# EAGLE design ENTRENADOR_SMD (EAGLE 9.6.2)
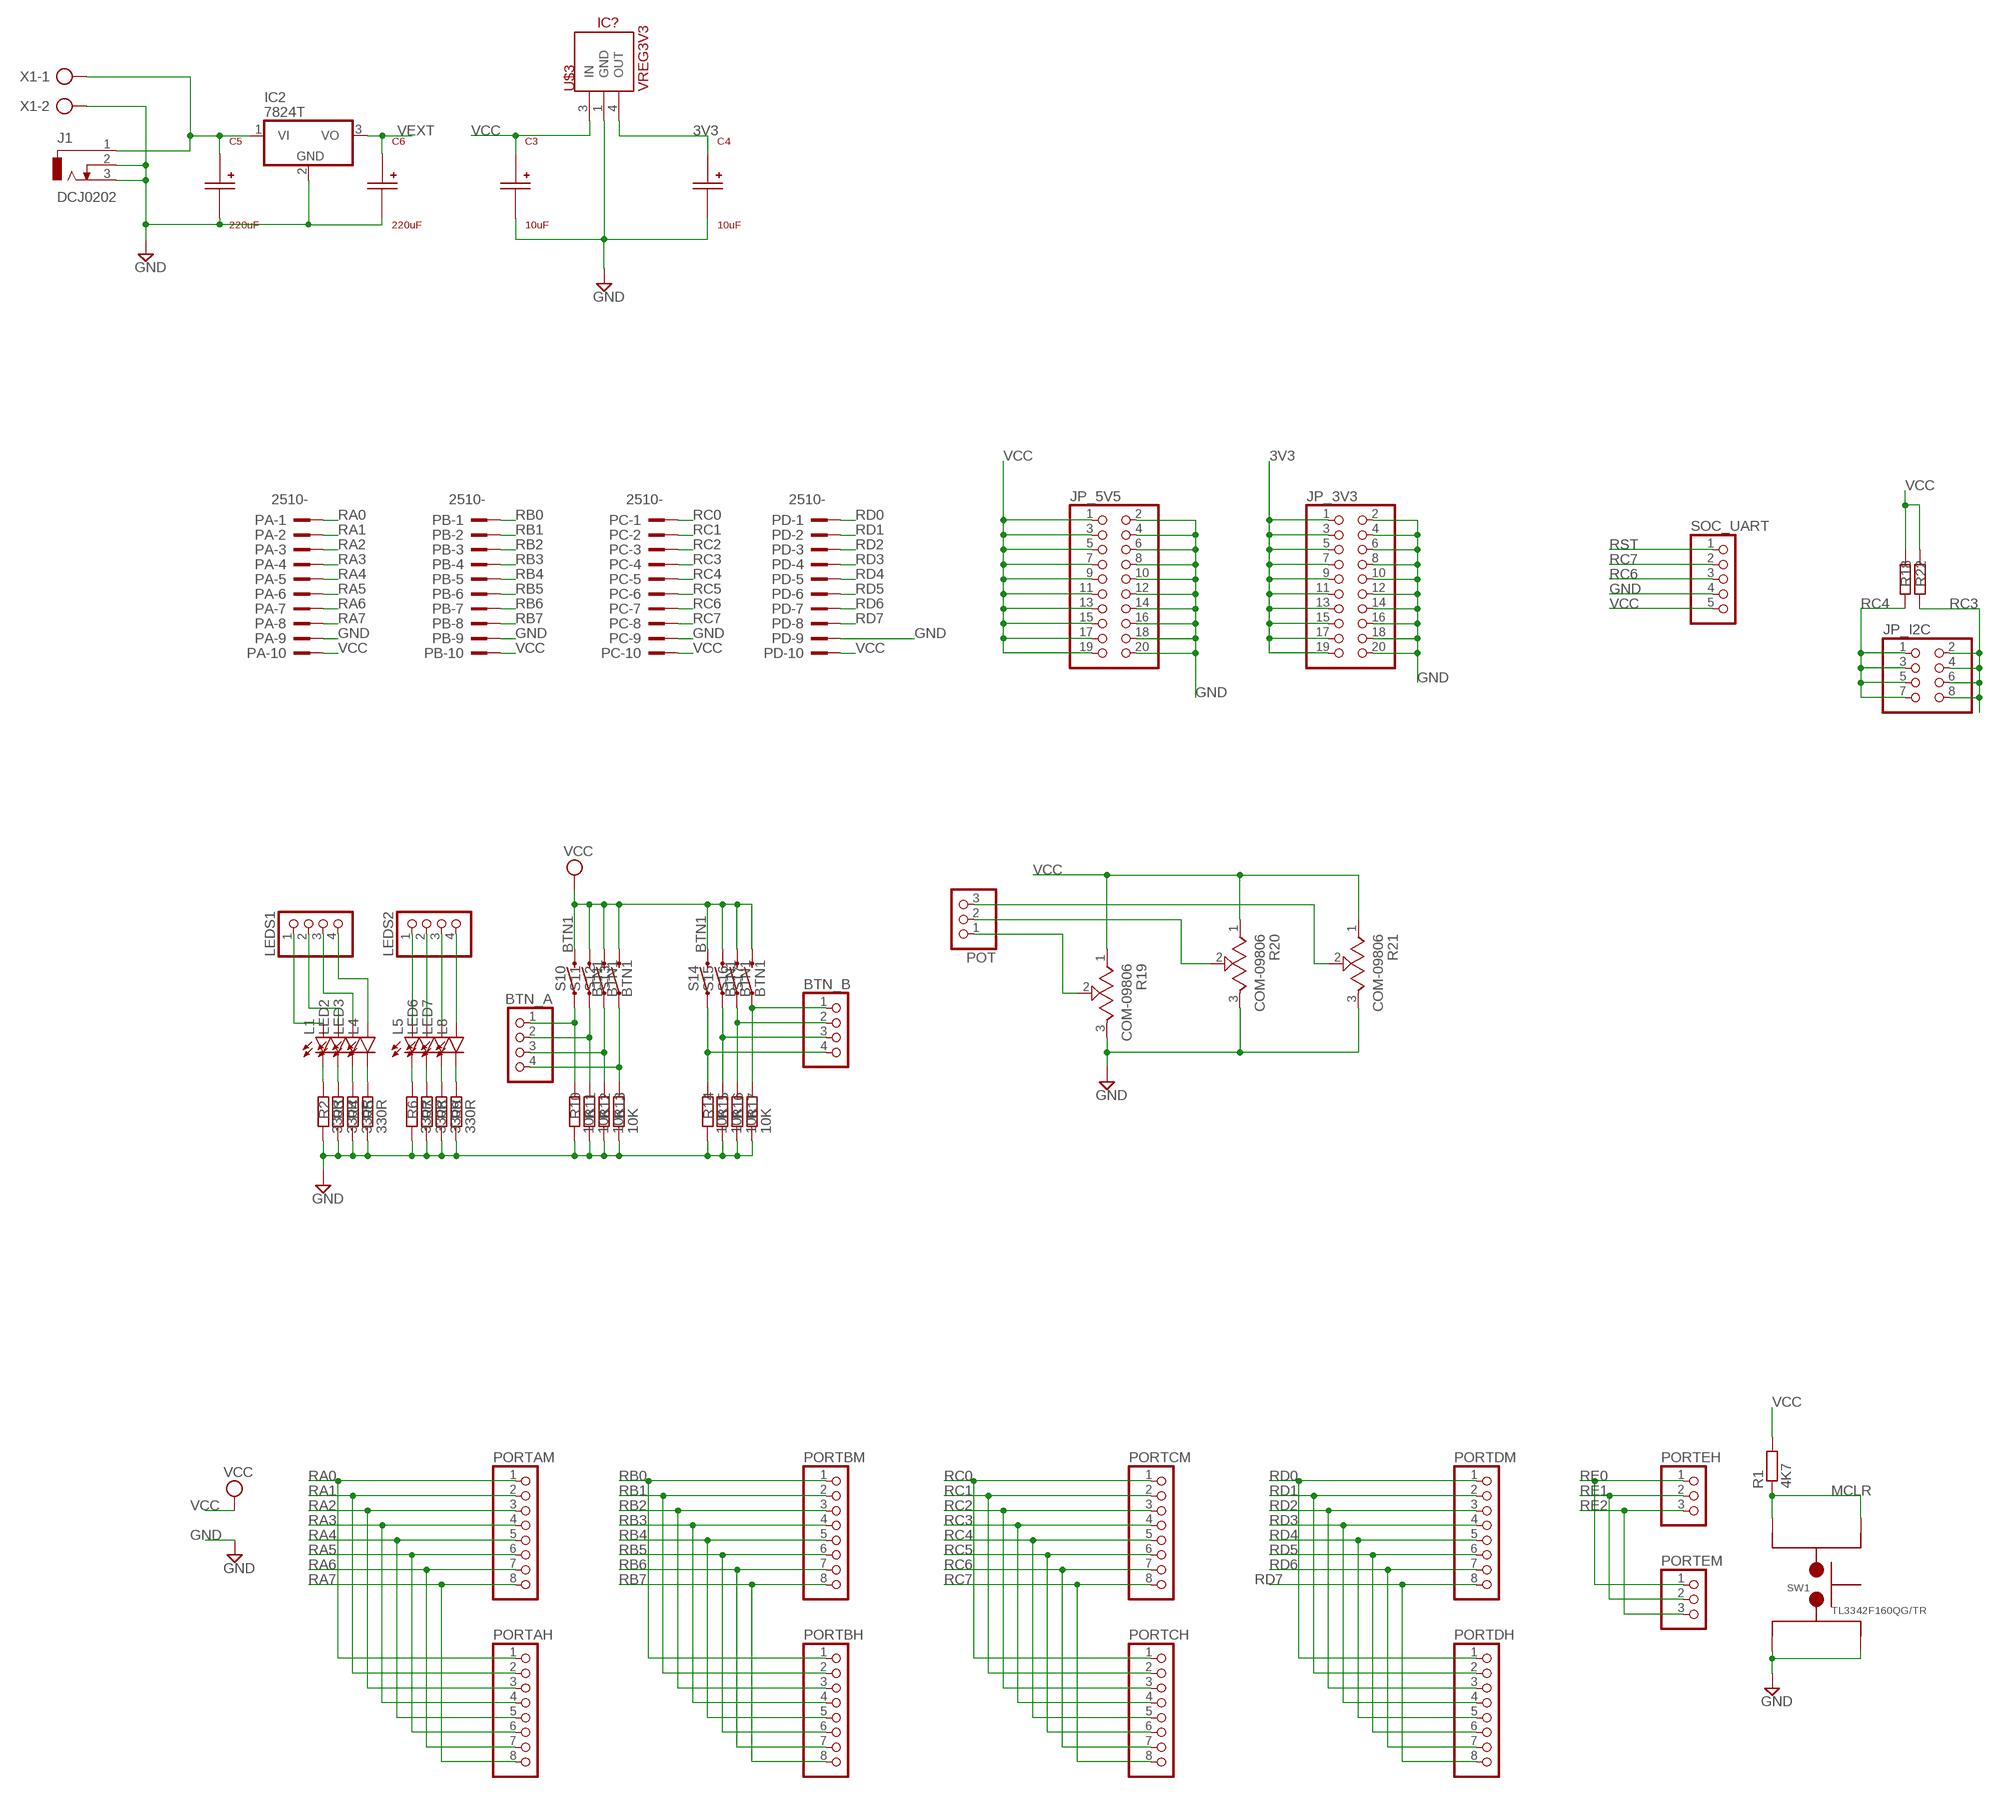
[diagram p0: schematic, sheet 1, part 1 of 2]
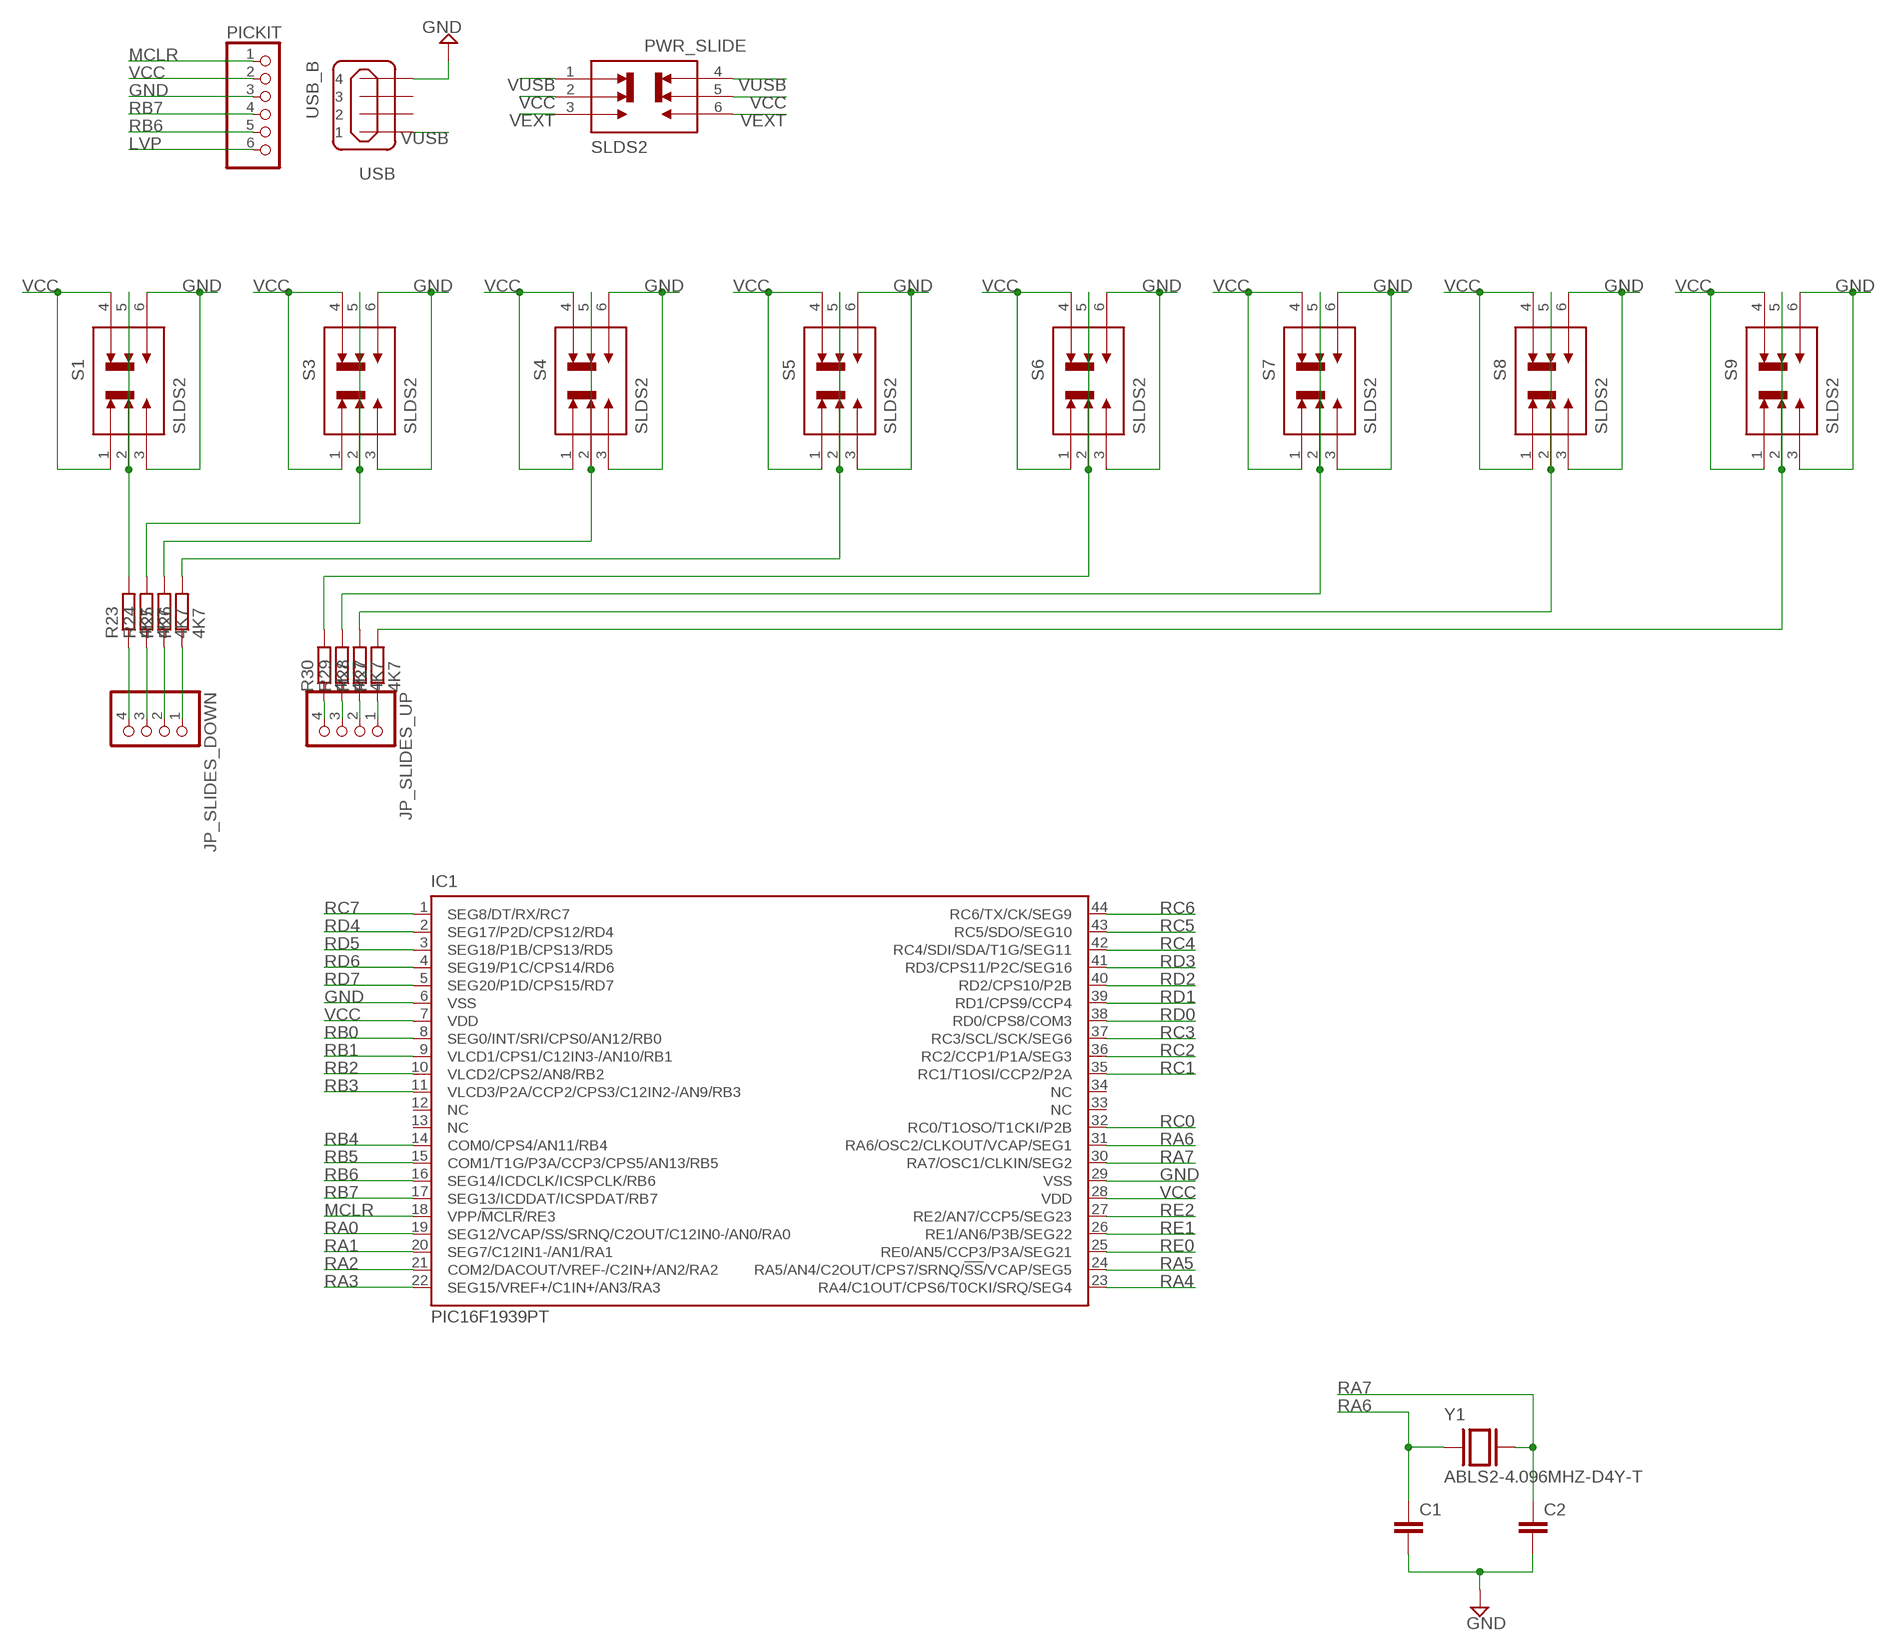
[diagram p1: schematic, sheet 1, part 2 of 2]

## Parts
BTN_A  PINHD-1X4  [1X04]
BTN_B  PINHD-1X4  [1X04]
C1  C-EUC0805K  [C0805K]
C2  C-EUC0805K  [C0805K]
C3  10uF  CAPA  [CAPA]
C4  10uF  CAPA  [CAPA]
C5  220uF  CAPA  [CAPA]
C6  220uF  CAPA  [CAPA]
IC1  PIC16F1939PT  [TQFP44]
IC2  7824T  [TO220H]
J1  DCJ0202  [DCJ0202]
JP_3V3  PINHD-2X10  [2X10]
JP_5V5  PINHD-2X10  [2X10]
JP_I2C  PINHD-2X4  [2X04]
JP_SLIDES_DOWN  PINHD-1X4  [1X04]
JP_SLIDES_UP  PINHD-1X4  [1X04]
L1  LEDCHIP-LED0805  [CHIP-LED0805]
L4  LEDCHIP-LED0805  [CHIP-LED0805]
L5  LEDCHIP-LED0805  [CHIP-LED0805]
L8  LEDCHIP-LED0805  [CHIP-LED0805]
LED2  LEDCHIP-LED0805  [CHIP-LED0805]
LED3  LEDCHIP-LED0805  [CHIP-LED0805]
LED6  LEDCHIP-LED0805  [CHIP-LED0805]
LED7  LEDCHIP-LED0805  [CHIP-LED0805]
LEDS1  PINHD-1X4  [1X04]
LEDS2  PINHD-1X4  [1X04]
PA  2510-  [PAK100/2500-10]
PB  2510-  [PAK100/2500-10]
PC  2510-  [PAK100/2500-10]
PD  2510-  [PAK100/2500-10]
PICKIT  PINHD-1X6  [1X06]
PORTAH  PINHD-1X8  [1X08]
PORTAM  PINHD-1X8  [1X08]
PORTBH  PINHD-1X8  [1X08]
PORTBM  PINHD-1X8  [1X08]
PORTCH  PINHD-1X8  [1X08]
PORTCM  PINHD-1X8  [1X08]
PORTDH  PINHD-1X8  [1X08]
PORTDM  PINHD-1X8  [1X08]
PORTEH  PINHD-1X3  [1X03]
PORTEM  PINHD-1X3  [1X03]
POT  PINHD-1X3  [1X03]
PWR_SLIDE  SLDS2  JS202011SCQN  [SW_JS202011SCQN]
R1  4K7  R-EU_R0805  [R0805]
R2  330R  R-EU_R0805  [R0805]
R3  330R  R-EU_R0805  [R0805]
R4  330R  R-EU_R0805  [R0805]
R5  330R  R-EU_R0805  [R0805]
R6  330R  R-EU_R0805  [R0805]
R7  330R  R-EU_R0805  [R0805]
R8  330R  R-EU_R0805  [R0805]
R9  330R  R-EU_R0805  [R0805]
R10  10K  R-EU_R0805  [R0805]
R11  10K  R-EU_R0805  [R0805]
R12  10K  R-EU_R0805  [R0805]
R13  10K  R-EU_R0805  [R0805]
R14  10K  R-EU_R0805  [R0805]
R15  10K  R-EU_R0805  [R0805]
R16  10K  R-EU_R0805  [R0805]
R17  10K  R-EU_R0805  [R0805]
R18  R-EU_R0805  [R0805]
R19  COM-09806  [TRIM_COM-09806]
R20  COM-09806  [TRIM_COM-09806]
R21  COM-09806  [TRIM_COM-09806]
R22  R-EU_R0805  [R0805]
R23  4K7  R-EU_R0805  [R0805]
R24  4K7  R-EU_R0805  [R0805]
R25  4K7  R-EU_R0805  [R0805]
R26  4K7  R-EU_R0805  [R0805]
R27  4K7  R-EU_R0805  [R0805]
R28  4K7  R-EU_R0805  [R0805]
R29  4K7  R-EU_R0805  [R0805]
R30  4K7  R-EU_R0805  [R0805]
S1  SLDS2  JS202011SCQN  [SW_JS202011SCQN]
S3  SLDS2  JS202011SCQN  [SW_JS202011SCQN]
S4  SLDS2  JS202011SCQN  [SW_JS202011SCQN]
S5  SLDS2  JS202011SCQN  [SW_JS202011SCQN]
S6  SLDS2  JS202011SCQN  [SW_JS202011SCQN]
S7  SLDS2  JS202011SCQN  [SW_JS202011SCQN]
S8  SLDS2  JS202011SCQN  [SW_JS202011SCQN]
S9  SLDS2  JS202011SCQN  [SW_JS202011SCQN]
S10  BTN1  PTS636SM25FSMTRLFS-SMD-6.0X3.5MM  [TACTILE_SWITCH_SMD_6.0X3.5MM]
S11  BTN1  PTS636SM25FSMTRLFS-SMD-6.0X3.5MM  [TACTILE_SWITCH_SMD_6.0X3.5MM]
S12  BTN1  PTS636SM25FSMTRLFS-SMD-6.0X3.5MM  [TACTILE_SWITCH_SMD_6.0X3.5MM]
S13  BTN1  PTS636SM25FSMTRLFS-SMD-6.0X3.5MM  [TACTILE_SWITCH_SMD_6.0X3.5MM]
S14  BTN1  PTS636SM25FSMTRLFS-SMD-6.0X3.5MM  [TACTILE_SWITCH_SMD_6.0X3.5MM]
S15  BTN1  PTS636SM25FSMTRLFS-SMD-6.0X3.5MM  [TACTILE_SWITCH_SMD_6.0X3.5MM]
S16  BTN1  PTS636SM25FSMTRLFS-SMD-6.0X3.5MM  [TACTILE_SWITCH_SMD_6.0X3.5MM]
S17  BTN1  PTS636SM25FSMTRLFS-SMD-6.0X3.5MM  [TACTILE_SWITCH_SMD_6.0X3.5MM]
SOC_UART  PINHD-1X5  [1X05]
SW1  TL3342F160QG/TR  [SW_TL3342F160QG/TR]
U$3  VREG3V3  [VREG3V3]
USB  USB_B  MINI-USB_4P-85-32004-10X  [85-32004-10X]
X1  AK300/2  [AK300/2]
Y1  ABLS2-4.096MHZ-D4Y-T  [XTAL_ABLS2-4.096MHZ-D4Y-T]

## Nets
3V3: C4.P JP_3V3.1 JP_3V3.3 JP_3V3.5 JP_3V3.7 JP_3V3.9 JP_3V3.11 JP_3V3.13 JP_3V3.15 JP_3V3.17 JP_3V3.19 U$3.4(OUT)
GND: C1.2 C2.2 C3.N C4.N C5.N C6.N IC1.6(VSS) IC1.29(VSS) IC2.2(GND) J1.2 J1.3 JP_3V3.2 JP_3V3.4 JP_3V3.6 JP_3V3.8 JP_3V3.10 JP_3V3.12 JP_3V3.14 JP_3V3.16 JP_3V3.18 JP_3V3.20 JP_5V5.2 JP_5V5.4 JP_5V5.6 JP_5V5.8 JP_5V5.10 JP_5V5.12 JP_5V5.14 JP_5V5.16 JP_5V5.18 JP_5V5.20 PA.9 PB.9 PC.9 PD.9 PICKIT.3 R2.1 R3.1 R4.1 R5.1 R6.1 R7.1 R8.1 R9.1 R10.1 R11.1 R12.1 R13.1 R14.1 R15.1 R16.1 R17.1 R19.3(CW) R20.3(CW) R21.3(CW) S1.3 S1.6 S3.3 S3.6 S4.3 S4.6 S5.3 S5.6 S6.3 S6.6 S7.3 S7.6 S8.3 S8.6 S9.3 S9.6 SOC_UART.4 SW1.1 SW1.2 U$3.1(GND) USB.4 X1.2
LVP: PICKIT.6
MCLR: IC1.18(VPP/!MCLR!/RE3) PICKIT.1 R1.1 SW1.3 SW1.4
N$1: R23.2 S1.2 S1.5
N$2: R24.2 S3.2 S3.5
N$3: R25.2 S4.2 S4.5
N$4: R26.2 S5.2 S5.5
N$5: R30.2 S6.2 S6.5
N$6: R29.2 S7.2 S7.5
N$7: R28.2 S8.2 S8.5
N$8: R27.2 S9.2 S9.5
N$9: L1.C R2.2
N$10: LED2.C R3.2
N$11: LED3.C R4.2
N$12: L4.C R5.2
N$13: L5.C R6.2
N$14: LED6.C R7.2
N$15: LED7.C R8.2
N$16: L8.C R9.2
N$17: L1.A LEDS1.1
N$18: LED2.A LEDS1.2
N$19: LED3.A LEDS1.3
N$20: L4.A LEDS1.4
N$21: L5.A LEDS2.1
N$22: LED6.A LEDS2.2
N$23: LED7.A LEDS2.3
N$24: L8.A LEDS2.4
N$25: BTN_A.1 R10.2 S10.1
N$26: BTN_A.2 R11.2 S11.1
N$27: BTN_A.3 R12.2 S12.1
N$28: BTN_A.4 R13.2 S13.1
N$29: BTN_B.4 R14.2 S14.1
N$30: BTN_B.3 R15.2 S15.1
N$31: BTN_B.2 R16.2 S16.1
N$32: BTN_B.1 R17.2 S17.1
N$33: POT.3 R21.2(WIPER)
N$34: POT.2 R20.2(WIPER)
N$35: POT.1 R19.2(WIPER)
N$36: C5.P IC2.1(VI) J1.1 X1.1
N$37: JP_SLIDES_UP.1 R27.1
N$38: JP_SLIDES_UP.2 R28.1
N$39: JP_SLIDES_UP.3 R29.1
N$40: JP_SLIDES_DOWN.1 R26.1
N$41: JP_SLIDES_DOWN.2 R25.1
N$42: JP_SLIDES_DOWN.3 R24.1
N$43: JP_SLIDES_DOWN.4 R23.1
N$44: JP_SLIDES_UP.4 R30.1
RA0: IC1.19(SEG12/VCAP/SS/SRNQ/C2OUT/C12IN0-/AN0/RA0) PA.1 PORTAH.1 PORTAM.1
RA1: IC1.20(SEG7/C12IN1-/AN1/RA1) PA.2 PORTAH.2 PORTAM.2
RA2: IC1.21(COM2/DACOUT/VREF-/C2IN+/AN2/RA2) PA.3 PORTAH.3 PORTAM.3
RA3: IC1.22(SEG15/VREF+/C1IN+/AN3/RA3) PA.4 PORTAH.4 PORTAM.4
RA4: IC1.23(RA4/C1OUT/CPS6/T0CKI/SRQ/SEG4) PA.5 PORTAH.5 PORTAM.5
RA5: IC1.24(RA5/AN4/C2OUT/CPS7/SRNQ/!SS!/VCAP/SEG5) PA.6 PORTAH.6 PORTAM.6
RA6: C1.1 IC1.31(RA6/OSC2/CLKOUT/VCAP/SEG1) PA.7 PORTAH.7 PORTAM.7 Y1.1
RA7: C2.1 IC1.30(RA7/OSC1/CLKIN/SEG2) PA.8 PORTAH.8 PORTAM.8 Y1.2
RB0: IC1.8(SEG0/INT/SRI/CPS0/AN12/RB0) PB.1 PORTBH.1 PORTBM.1
RB1: IC1.9(VLCD1/CPS1/C12IN3-/AN10/RB1) PB.2 PORTBH.2 PORTBM.2
RB2: IC1.10(VLCD2/CPS2/AN8/RB2) PB.3 PORTBH.3 PORTBM.3
RB3: IC1.11(VLCD3/P2A/CCP2/CPS3/C12IN2-/AN9/RB3) PB.4 PORTBH.4 PORTBM.4
RB4: IC1.14(COM0/CPS4/AN11/RB4) PB.5 PORTBH.5 PORTBM.5
RB5: IC1.15(COM1/T1G/P3A/CCP3/CPS5/AN13/RB5) PB.6 PORTBH.6 PORTBM.6
RB6: IC1.16(SEG14/ICDCLK/ICSPCLK/RB6) PB.7 PICKIT.5 PORTBH.7 PORTBM.7
RB7: IC1.17(SEG13/ICDDAT/ICSPDAT/RB7) PB.8 PICKIT.4 PORTBH.8 PORTBM.8
RC0: IC1.32(RC0/T1OSO/T1CKI/P2B) PC.1 PORTCH.1 PORTCM.1
RC1: IC1.35(RC1/T1OSI/CCP2/P2A) PC.2 PORTCH.2 PORTCM.2
RC2: IC1.36(RC2/CCP1/P1A/SEG3) PC.3 PORTCH.3 PORTCM.3
RC3: IC1.37(RC3/SCL/SCK/SEG6) JP_I2C.2 JP_I2C.4 JP_I2C.6 JP_I2C.8 PC.4 PORTCH.4 PORTCM.4 R22.1
RC4: IC1.42(RC4/SDI/SDA/T1G/SEG11) JP_I2C.1 JP_I2C.3 JP_I2C.5 JP_I2C.7 PC.5 PORTCH.5 PORTCM.5 R18.1
RC5: IC1.43(RC5/SDO/SEG10) PC.6 PORTCH.6 PORTCM.6
RC6: IC1.44(RC6/TX/CK/SEG9) PC.7 PORTCH.7 PORTCM.7 SOC_UART.3
RC7: IC1.1(SEG8/DT/RX/RC7) PC.8 PORTCH.8 PORTCM.8 SOC_UART.2
RD0: IC1.38(RD0/CPS8/COM3) PD.1 PORTDH.1 PORTDM.1
RD1: IC1.39(RD1/CPS9/CCP4) PD.2 PORTDH.2 PORTDM.2
RD2: IC1.40(RD2/CPS10/P2B) PD.3 PORTDH.3 PORTDM.3
RD3: IC1.41(RD3/CPS11/P2C/SEG16) PD.4 PORTDH.4 PORTDM.4
RD4: IC1.2(SEG17/P2D/CPS12/RD4) PD.5 PORTDH.5 PORTDM.5
RD5: IC1.3(SEG18/P1B/CPS13/RD5) PD.6 PORTDH.6 PORTDM.6
RD6: IC1.4(SEG19/P1C/CPS14/RD6) PD.7 PORTDH.7 PORTDM.7
RD7: IC1.5(SEG20/P1D/CPS15/RD7) PD.8 PORTDH.8 PORTDM.8
RE0: IC1.25(RE0/AN5/CCP3/P3A/SEG21) PORTEH.1 PORTEM.1
RE1: IC1.26(RE1/AN6/P3B/SEG22) PORTEH.2 PORTEM.2
RE2: IC1.27(RE2/AN7/CCP5/SEG23) PORTEH.3 PORTEM.3
RST: SOC_UART.1
VCC: C3.P IC1.7(VDD) IC1.28(VDD) JP_5V5.1 JP_5V5.3 JP_5V5.5 JP_5V5.7 JP_5V5.9 JP_5V5.11 JP_5V5.13 JP_5V5.15 JP_5V5.17 JP_5V5.19 PA.10 PB.10 PC.10 PD.10 PICKIT.2 PWR_SLIDE.2 PWR_SLIDE.5 R1.2 R18.2 R19.1(CCW) R20.1(CCW) R21.1(CCW) R22.2 S1.1 S1.4 S3.1 S3.4 S4.1 S4.4 S5.1 S5.4 S6.1 S6.4 S7.1 S7.4 S8.1 S8.4 S9.1 S9.4 S10.2 S11.2 S12.2 S13.2 S14.2 S15.2 S16.2 S17.2 SOC_UART.5 U$3.3(IN)
VEXT: C6.P IC2.3(VO) PWR_SLIDE.3 PWR_SLIDE.6
VUSB: PWR_SLIDE.1 PWR_SLIDE.4 USB.1
Unconnected: IC1.12(NC) IC1.13(NC) IC1.33(NC) IC1.34(NC) USB.2 USB.3

## Library data of the parts
BTN_A BTN_B JP_SLIDES_DOWN JP_SLIDES_UP LEDS1 LEDS2 = pinhead:PINHD-1X4: PIN HEADER
C1 C2 = mi_rcl:C-EU: CAPACITOR, European symbol; SPICEPREFIX: C
C3-C6 = CAPAE830X1000N:CAPA
IC1 = microchip:PIC16F193*: Flash-Based, 8-Bit CMOS Microcontrollers wtih LCD Driver and nanoWatt XLP Technology Auto generated by make-symbol-device-package-bsdl.ulp Rev. 33 Source: http://ww1.microchip.com/downloads/en/DeviceDoc/41364D.pdf; MPN: PIC16F1939-I/PT; OC_FARNELL: 1755834; OC_NEWARK: 08R1959
IC2 = linear:78*: Positive VOLTAGE REGULATOR Source: http://cache.national.com/ds/LM/LM78L05.pdf http://www.fairchildsemi.com/ds/LM/LM7805.pdf
J1 = con-jack:DCJ0202: DC POWER JACK Source: DCJ0202.pdf; OC_FARNELL: unknown; OC_NEWARK: unknown
JP_3V3 JP_5V5 = pinhead:PINHD-2X10: PIN HEADER
JP_I2C = pinhead:PINHD-2X4: PIN HEADER
L1 L4 L5 L8 LED2 LED3 LED6 LED7 = led:LED: LED OSRAM: - CHIPLED LG R971, LG N971, LY N971, LG Q971, LY Q971, LO R971, LY R971 LH N974, LH R974 LS Q976, LO Q976, LY Q976 LO Q996 - Hyper CHIPLED LW Q18S LB Q993, LB Q99A, LB R99A - SideLED LS A670, LO A670, LY A670, LG A670, LP A670 LB A673, LV A673, LT A673, LW A673 LH A674 LY A675 LS A676, LA A676, LO A676, LY A676, LW A676 LS A679, LY A679, LG A679 - Hyper Micro SIDELED® LS Y876, LA Y876, LO Y876, LY Y876 LT Y87S - SmartLED LW L88C, LW L88S LB L89C, LB L89S, LG L890 LS L89K, LO L89K, LY L89K LS L896, LA L896, LO L896, LY L896 - TOPLED LS T670, LO T670, LY T670, LG T670, LP T670 LSG T670, LSP T670, LSY T670, LOP T670, LYG T670 LG T671, LOG T671, LSG T671 LB T673, LV T673, LT T673, LW T673 LH T674 LS T676, LA T676, LO T676, LY T676, LB T676, LH T676, LSB T676, LW T676 LB T67C, LV T67C, LT T67C, LS T67K, LO T67K, LY T67K, LW E67C LS E67B, LA E67B, LO E67B, LY E67B, LB E67C, LV E67C, LT E67C LW T67C LS T679, LY T679, LG T679 LS T770, LO T770, LY T770, LG T770, LP T770 LB T773, LV T773, LT T773, LW T773 LH T774 LS E675, LA E675, LY E675, LS T675 LS T776, LA T776, LO T776, LY T776, LB T776 LHGB T686 LT T68C, LB T68C - Hyper Mini TOPLED® LB M676 - Mini TOPLED Santana® LG M470 LS M47K, LO M47K, LY M47K Source: http://www.osram.convergy.de LUXEON: - LUMILED® LXK2-PW12-R00, LXK2-PW12-S00, LXK2-PW14-U00, LXK2-PW14-V00 LXK2-PM12-R00, LXK2-PM12-S00, LXK2-PM14-U00 LXK2-PE12-Q00, LXK2-PE12-R00, LXK2-PE12-S00, LXK2-PE14-T00, LXK2-PE14-U00 LXK2-PB12-K00, LXK2-PB12-L00, LXK2-PB12-M00, LXK2-PB14-N00, LXK2-PB14-P00, LXK2-PB14-Q00 LXK2-PR12-L00, LXK2-PR12-M00, LXK2-PR14-Q00, LXK2-PR14-R00 LXK2-PD12-Q00, LXK2-PD12-R00, LXK2-PD12-S00 LXK2-PH12-R00, LXK2-PH12-S00 LXK2-PL12-P00, LXK2-PL12-Q00, LXK2-PL12-R00 Source: www.luxeon.com KINGBRIGHT: KA-3528ASYC Source: www.kingbright.com
PA PB PC PD = con-3m:2510-: 3M (TM) Pak 100 4-Wall Header Source: 3M; MF: 3M; MPN: 2510-6002UB; OC_FARNELL: 9838244; OC_NEWARK: 46F4725
PICKIT = pinhead:PINHD-1X6: PIN HEADER
PORTAH PORTAM PORTBH PORTBM PORTCH PORTCM PORTDH PORTDM = pinhead:PINHD-1X8: PIN HEADER
PORTEH PORTEM POT = pinhead:PINHD-1X3: PIN HEADER
PWR_SLIDE S1 S3-S9 = JS202011SCQN:JS202011SCQN: Check availability <https://pricing.snapeda.com/parts/JS202011SCQN/C%26K/view-part?ref=eda>; AVAILABILITY: In Stock; DESCRIPTION: Slide Switch DPDT Surface Mount; MF: C&K; MP: JS202011SCQN; PACKAGE: None; PRICE: None; PURCHASE-URL: https://pricing.snapeda.com/search?q=JS202011SCQN&ref=eda
R1-R18 R22-R30 = R0805_:R-EU_: RESISTOR, European symbol; SPICEPREFIX: R
R19-R21 = COM-09806:COM-09806: 10 kOhms 0.5W, 1/2W PC Pins Through Hole Trimmer Potentiometer Cermet 1 Turn Top Adjustment Check availability <https://pricing.snapeda.com/parts/COM-09806/SparkFun%20Electronics/view-part?ref=eda>; AVAILABILITY: In Stock; DESCRIPTION: 10 kOhms 0.5W, 1/2W PC Pins Through Hole Trimmer Potentiometer Cermet 1.0 Turn Top Adjustment; MF: SparkFun Electronics; MP: COM-09806; PACKAGE: DIP-3 SparkFun Electronics; PRICE: None; PURCHASE-URL: https://pricing.snapeda.com/search?q=COM-09806&ref=eda
S10-S17 = PTS636SM25FSMTRLFS:PTS636SM25FSMTRLFS: Momentary Switch (Pushbutton) - SPST Tactile Switch SPST-NO Top Actuated Surface Mount . Variants PTS636 SM25F SMTR LFS Momentary Pushbutton Switch - 12mm Square <https://www.snapeda.com/parts/PTS636%20SM25F%20SMTR%20LFS/C&K/datasheet/> PTS636 SM25F SMTR LFS Check availability <https://pricing.snapeda.com/parts/PTS636SM25FSMTRLFS/CK/view-part?ref=eda>; AVAILABILITY: In Stock; DESCRIPTION: Switch Tactile N.O. SPST Rectangular Button F-Lead 0.05A 12VDC 1.77N SMD T/R; MF: CK; MP: PTS636SM25FSMTRLFS; PACKAGE: None; PRICE: None
SOC_UART = pinhead:PINHD-1X5: PIN HEADER
SW1 = TL3342F160QG_TR:TL3342F160QG/TR: TL3342 Series SPST 1.6 N Round Button Gull Wing Surface Mount Tactile Switch Check availability <https://pricing.snapeda.com/parts/TL3342F160QG/TR/E-Switch/view-part?ref=eda>; AVAILABILITY: In Stock; DESCRIPTION: Tactile Switch SPST-NO Top Actuated Surface Mount; MF: E-Switch; MP: TL3342F160QG/TR; PACKAGE: None; PRICE: None; PURCHASE-URL: https://pricing.snapeda.com/search?q=TL3342F160QG/TR&ref=eda
U$3 = VREG_L7805ACD2T:VREG3V3
USB = con-cypressindustries:MINI-USB_4P-: MINI USB 4 Pol. Source: www.cypressindustries.com; OC_FARNELL: unknown; OC_NEWARK: unknown
X1 = con-ptr500:AK300/2: CONNECTOR; OC_FARNELL: unknown; OC_NEWARK: unknown
Y1 = ABLS2-4.096MHZ-D4Y-T:ABLS2-4.096MHZ-D4Y-T: Check availability <https://pricing.snapeda.com/parts/ABLS2-4.096MHZ-D4Y-T/Abracon%20LLC/view-part?ref=eda>; AVAILABILITY: In Stock; DESCRIPTION: 4.096 MHz ±30ppm Crystal 18pF 180 Ohms HC-49/US; MF: Abracon LLC; MP: ABLS2-4.096MHZ-D4Y-T; PACKAGE: None; PRICE: None; PURCHASE-URL: https://pricing.snapeda.com/search?q=ABLS2-4.096MHZ-D4Y-T&ref=eda

## Board
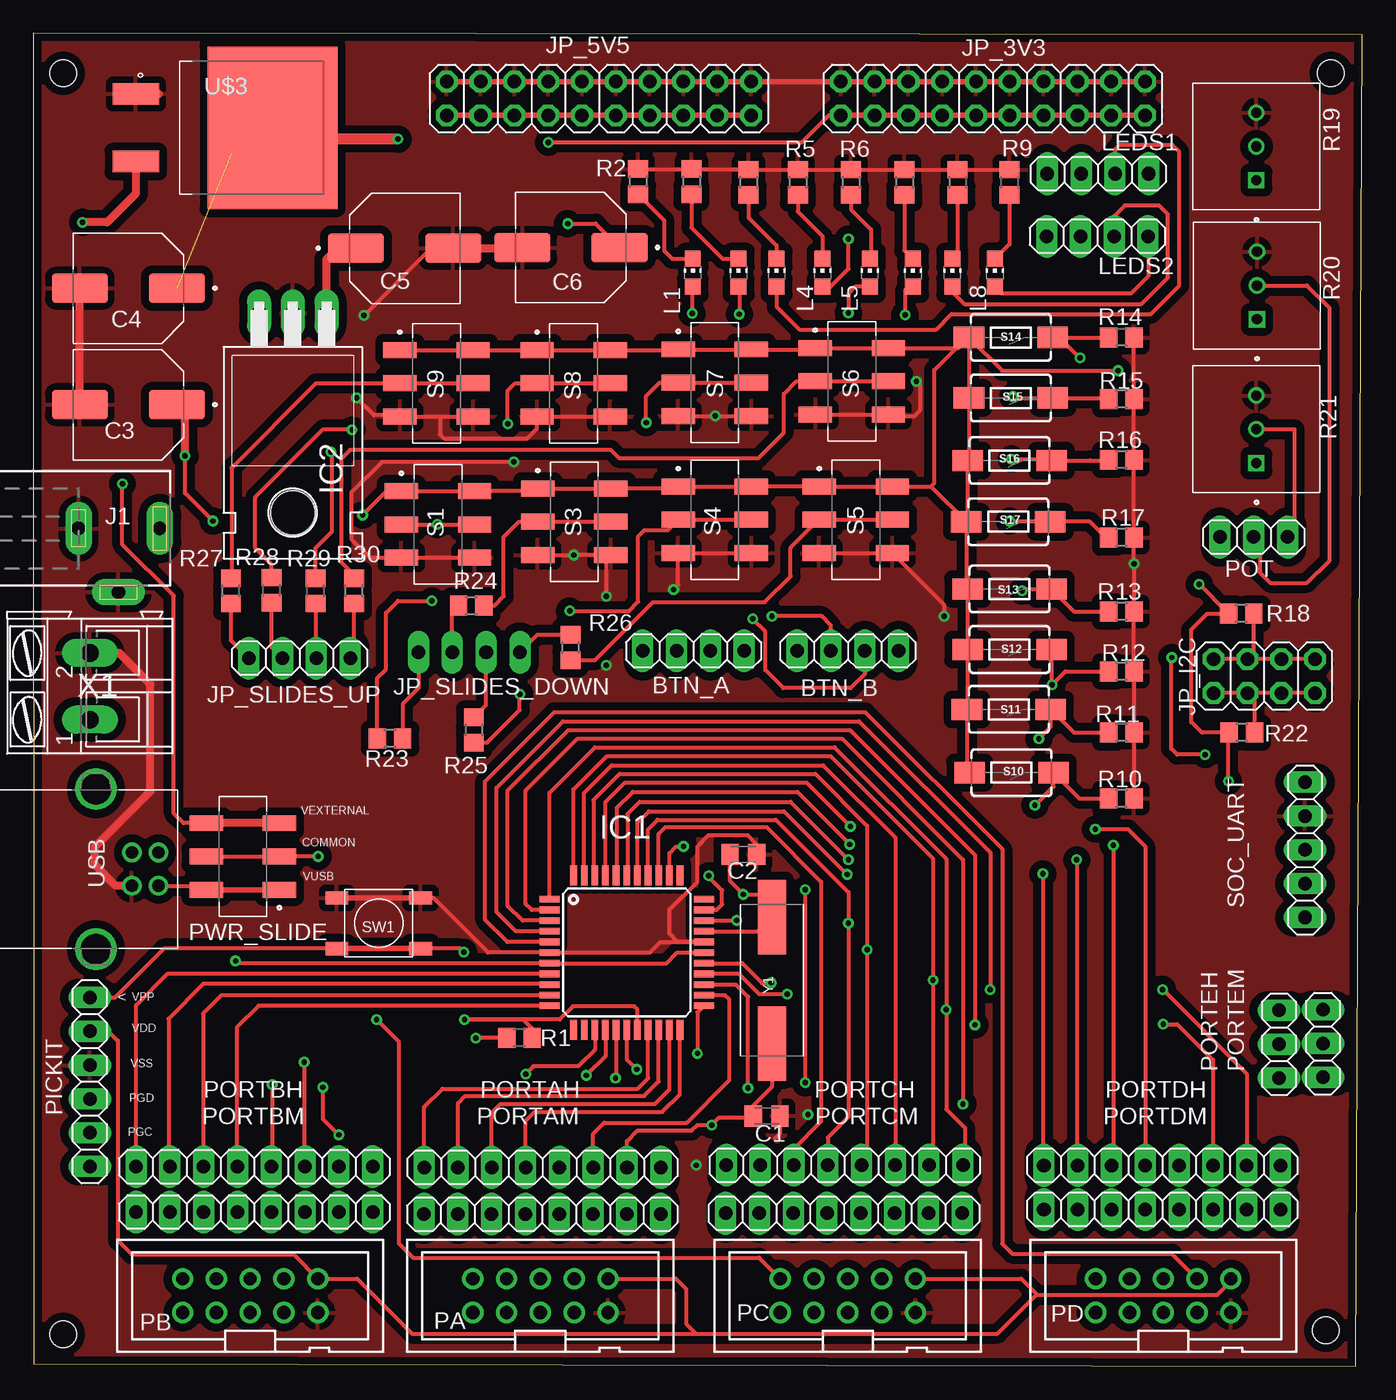
[diagram p2: board, top side]
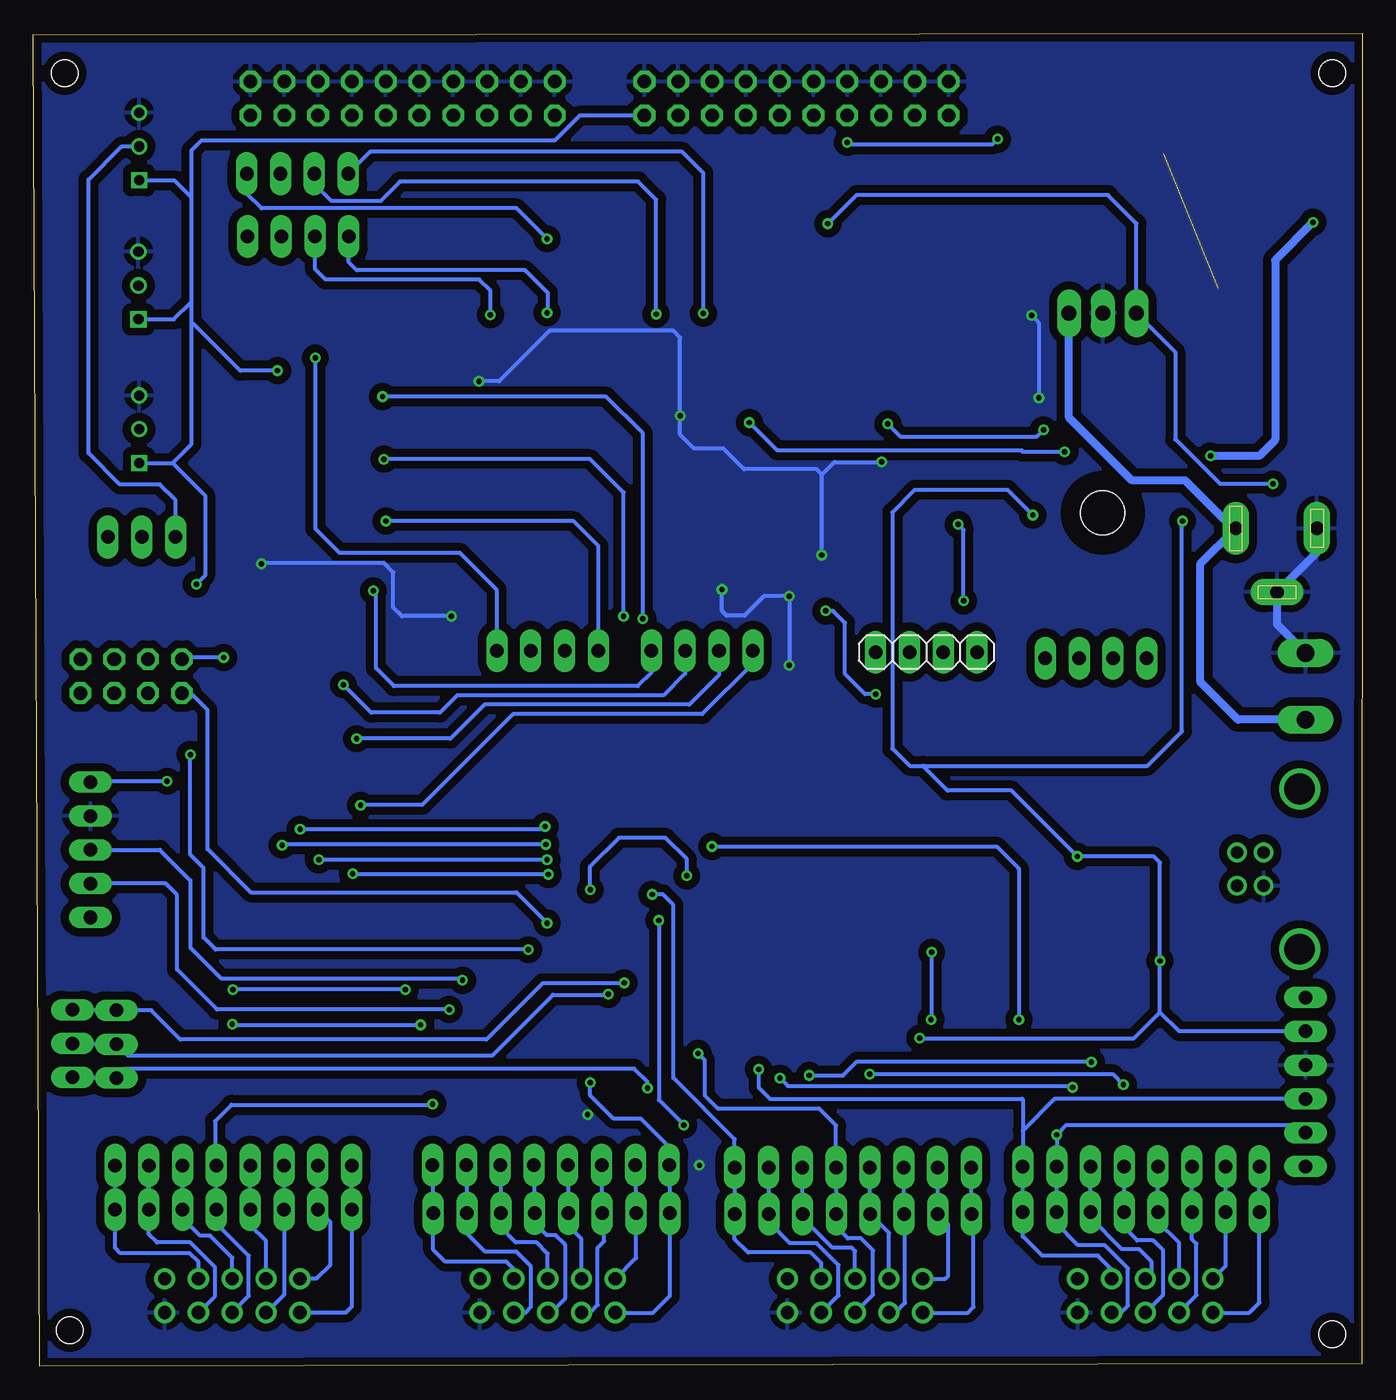
[diagram p3: board, bottom side, seen from below]

Size 99.85 x 100.15 mm. Coordinates in mm from the lower left corner, seen from the top.
Outline: 0.05,0.2 99.35,0 99.85,100.05 0,100.15 0.05,0.2
Copper layers (1*16): Top 0.035mm / dielectric 1.5mm / Bottom 0.035mm
Design rules "China_JLCPCB": minimum track width 0.25mm, minimum drill 0.4mm, track to track 0.24mm, track to pad 0.23mm, pad to pad 0.2mm, via to via 0.25mm, smd to smd 0.2mm, copper to edge 0.5mm, drill to drill 0.3mm, minimum pad ring 0.149mm, minimum via ring 0.2mm, stop-mask expansion 3mil, vias tented up to drill 0.6mm, thermal gap 20mil
Holes 2 mm at 2.25,2.4 97.1,2.7 97.5,97.15 2.25,97.15

### Footprints (pad centres in the part's own frame; a part is rotated, then mirrored left to right if it is on the bottom)
1X04 = drill 1.016 long: 1 -3.81,0; 2 -1.27,0; 3 1.27,0; 4 3.81,0
C0805K = smd 1.3 x 1.6: 1 -1,0; 2 1,0
CAPA = smd 4.2 x 2.2: N 3.65,0; P -3.65,0
TQFP44 = smd 1.5 x 0.5: 1 -5.8,4; 2 -5.8,3.2; 3 -5.8,2.4; 4 -5.8,1.6; 5 -5.8,0.8; 6 -5.8,0; 7 -5.8,-0.8; 8 -5.8,-1.6; 9 -5.8,-2.4; 10 -5.8,-3.2; 11 -5.8,-4; 23 5.8,-4; 24 5.8,-3.2; 25 5.8,-2.4; 26 5.8,-1.6; 27 5.8,-0.8; 28 5.8,0; 29 5.8,0.8; 30 5.8,1.6; 31 5.8,2.4; 32 5.8,3.2; 33 5.8,4 | smd 0.5 x 1.5: 12 -4,-5.8; 13 -3.2,-5.8; 14 -2.4,-5.8; 15 -1.6,-5.8; 16 -0.8,-5.8; 17 0,-5.8; 18 0.8,-5.8; 19 1.6,-5.8; 20 2.4,-5.8; 21 3.2,-5.8; 22 4,-5.8; 34 4,5.8; 35 3.2,5.8; 36 2.4,5.8; 37 1.6,5.8; 38 0.8,5.8; 39 0,5.8; 40 -0.8,5.8; 41 -1.6,5.8; 42 -2.4,5.8; 43 -3.2,5.8; 44 -4,5.8
TO220H = drill 1.118 long: 1 -2.54,-10.16; 2 0,-10.16; 3 2.54,-10.16 | hole 3.302: 0,4.826
DCJ0202 = drill 1 pad 2 long: 1 0,3.1; 2 4.8,0; 3 0,-3
2X10 = drill 1.016 octagon: 1 -11.43,-1.27; 2 -11.43,1.27; 3 -8.89,-1.27; 4 -8.89,1.27; 5 -6.35,-1.27; 6 -6.35,1.27; 7 -3.81,-1.27; 8 -3.81,1.27; 9 -1.27,-1.27; 10 -1.27,1.27; 11 1.27,-1.27; 12 1.27,1.27; 13 3.81,-1.27; 14 3.81,1.27; 15 6.35,-1.27; 16 6.35,1.27; 17 8.89,-1.27; 18 8.89,1.27; 19 11.43,-1.27; 20 11.43,1.27
2X04 = drill 1.016 octagon: 1 -3.81,-1.27; 2 -3.81,1.27; 3 -1.27,-1.27; 4 -1.27,1.27; 5 1.27,-1.27; 6 1.27,1.27; 7 3.81,-1.27; 8 3.81,1.27
CHIP-LED0805 = smd 1.2 x 1.2: A 0,-1.05; C 0,1.05
PAK100/2500-10 = drill 1 pad 1.422: 1 -5.08,-1.27; 2 -5.08,1.27; 3 -2.54,-1.27; 4 -2.54,1.27; 5 0,-1.27; 6 0,1.27; 7 2.54,-1.27; 8 2.54,1.27; 9 5.08,-1.27; 10 5.08,1.27
1X06 = drill 1.016 long: 1 -6.35,0; 2 -3.81,0; 3 -1.27,0; 4 1.27,0; 5 3.81,0; 6 6.35,0
1X08 = drill 1.016 long: 1 -8.89,0; 2 -6.35,0; 3 -3.81,0; 4 -1.27,0; 5 1.27,0; 6 3.81,0; 7 6.35,0; 8 8.89,0
1X03 = drill 1.016 long: 1 -2.54,0; 2 0,0; 3 2.54,0
SW_JS202011SCQN = smd 1.2 x 2.5: 1 -2.5,-2.75; 2 0,-2.75; 3 2.5,-2.75; 4 -2.5,2.75; 5 0,2.75; 6 2.5,2.75
R0805 = smd 1.3 x 1.5: 1 -0.95,0; 2 0.95,0
TRIM_COM-09806 = drill 0.76 square: 1 -2.54,0 | drill 0.76: 2 0,0; 3 2.54,0
TACTILE_SWITCH_SMD_6.0X3.5MM = smd 2.3 x 1.6: 1 -3.15,0; 2 3.15,0
1X05 = drill 1.016 long: 1 -5.08,0; 2 -2.54,0; 3 0,0; 4 2.54,0; 5 5.08,0
SW_TL3342F160QG/TR = smd 1.7 x 1: 1 -3.15,-1.9; 2 3.15,-1.9; 3 -3.15,1.9; 4 3.15,1.9
VREG3V3 = smd 3.5 x 1.6: 1 -6.7,2.54; 3 -6.7,-2.54 | smd 9.75 x 12.2: 4 3.575,0
85-32004-10X = drill 0.92 pad 1.27: 1 4.71,-1.25; 2 4.71,1.25; 3 2.71,1.25; 4 2.71,-1.25 | drill 2.3 pad 3: M1 0,6.02; M2 0,-6.02
AK300/2 = drill 1.321 long: 1 -2.515,0; 2 2.489,0
XTAL_ABLS2-4.096MHZ-D4Y-T = smd 5.6 x 2.1: 1 -4.75,0; 2 4.75,0

### Placement (x,y rotation side)
BTN_A  49.6,53.75 0 top
BTN_B  61.2,53.75 0 top
C1  55.1,18.8 0 top
C2  53.35,38.45 0 top
C3  7.15,72.25 180 top
C4  7.15,81 180 top
C5  27.9,84 0 top
C6  40.4,84.05 180 top
IC1  44.59,31.08 0 top
IC2  19.5,68.95 180 top
J1  6.4,62.95 270 top
JP_3V3  72.1,95.25 0 top
JP_5V5  42.5,95.25 0 top
JP_I2C  92.5,51.85 180 top
JP_SLIDES_DOWN  32.75,53.65 0 bottom
JP_SLIDES_UP  20,53.2 0 top
L1  49.55,82.15 0 top
L4  59.3,82.15 0 top
L5  62.85,82.15 0 top
L8  72.25,82.15 0 top
LED2  53,82.15 0 top
LED3  55.85,82.15 0 top
LED6  66.1,82.15 0 top
LED7  69.05,82.15 0 top
LEDS1  80,89.6 0 top
LEDS2  79.95,84.9 0 top
PA  38.1,5.3 0 top
PB  16.3,5.3 0 top
PC  61.2,5.3 0 top
PD  84.9,5.3 0 top
PICKIT  4.25,21.35 270 top
PORTAH  38.26,14.94 0 top
PORTAM  38.24,11.42 0 top
PORTBH  16.61,14.99 0 top
PORTBM  16.61,11.58 0 top
PORTCH  60.96,15.1 0 top
PORTCM  60.91,11.49 0 top
PORTDH  84.82,15.09 0 top
PORTDM  84.82,11.78 0 top
PORTEH  93.6,24.2 90 top
PORTEM  96.9,24.25 90 top
POT  91.7,62.3 0 top
PWR_SLIDE  15.75,38.3 90 top
R1  36.52,24.67 180 top
R2  45.45,89 270 top
R3  49.45,89 270 top
R4  53.75,88.95 270 top
R5  57.45,88.95 270 top
R6  61.45,88.95 270 top
R7  65.45,88.95 270 top
R8  69.45,88.95 270 top
R9  73.35,88.95 270 top
R10  81.75,42.65 180 top
R11  81.75,47.6 180 top
R12  81.75,52.2 180 top
R13  81.75,56.7 180 top
R14  81.75,77.3 180 top
R15  81.75,72.65 180 top
R16  81.75,68.1 180 top
R17  81.75,62.25 180 top
R18  90.75,56.55 180 top
R19  91.9,91.65 90 top
R20  91.95,81.2 90 top
R21  91.9,70.4 90 top
R22  90.8,47.6 180 top
R23  26.8,47.15 180 top
R24  32.9,57.15 0 top
R25  33.1,47.8 270 top
R26  40.35,54 270 top
R27  14.85,58.25 90 top
R28  17.9,58.3 90 top
R29  21.2,58.25 90 top
R30  24.1,58.25 90 top
S1  30.4,63.25 270 top
S3  40.65,63.45 270 top
S4  51.2,63.6 270 top
S5  61.8,63.6 270 top
S6  61.5,74 270 top
S7  51.2,73.9 270 top
S8  40.6,73.85 270 top
S9  30.3,73.85 270 top
S10  73.5,44.6 180 top
S11  73.3,49.35 180 top
S12  73.35,53.85 180 top
S13  73.35,58.4 180 top
S14  73.45,77.3 180 top
S15  73.45,72.75 180 top
S16  73.35,68.05 180 top
S17  73.25,63.45 180 top
SOC_UART  95.55,38.8 90 top
SW1  25.95,33.28 180 top
U$3  14.4,93.05 0 top
USB  4.7,37.35 0 top
X1  4.25,51.1 90 top
Y1  55.5,29 90 top

### Tracks (layer width: path | path; a pad name or v marks a point on that pad's centre or on a via)
3V3  (via drill 0.4)  (1 unrouted)
  Top 0.254: U$3.4 17.02,92.1 16.4,92.1 15.9,92.1
  Top 0.3: v38.7,91.95 57.75,91.95 59.78,93.98 JP_3V3.1 | 16.5,92.2 16.4,92.1
  Top 0.406: JP_3V3.1 JP_3V3.3 JP_3V3.5 JP_3V3.7 JP_3V3.9 JP_3V3.11 JP_3V3.13 JP_3V3.15 JP_3V3.17 JP_3V3.19
  Top 0.61: 14.9,91.1 15.9,92.1
  Top 0.813: v27.4,92.2 16.5,92.2
  Bottom 0.3: v27.4,92.2 27.8,91.8 38.55,91.8 v38.7,91.95
GND  (via drill 0.4)
  Top 0.3: SW1.1 30.07,35.18 34.17,31.08 IC1.6 46.33,31.08 47.13,31.88 IC1.29 48.42,31.88 47.8,32.5 47.8,34.31 49.89,36.41 49.89,39.04 50.75,39.9 53.65,39.9 54.35,39.2 C2.2 | R2.1 R3.1 53.7,89.95 R4.1 R5.1 R6.1 R7.1 R8.1 R9.1 | v24.3,72.75 25.6,71.45 27.45,71.45 S9.3 30.55,71.35 | v24.85,78.95 29.9,84 C5.N | S1.6 S1.3 25.3,60.75 23.9,62.15 23.9,65.65 26.2,67.95 v36.1,67.95 | S3.3 v40.6,60.95 S3.6 43.05,60.6 v43.05,57.85 | S5.3 S5.6 68.45,57.2 v68.45,56.35 | 30.55,71.35 S9.6 | 30.55,71.35 30.55,70 30.85,69.7 37.1,69.7 37.85,70.45 S8.3 S8.6 | S7.3 v51.25,71.4 S7.6 | S6.3 S6.6 64.4,71.35 66.15,71.35 66.6,71.8 66.6,73.75 v66.35,74 | R14.1 R15.1 R16.1 R17.1 v82.7,60.3 R13.1 R12.1 R11.1 R10.1 | v48.1,58.35 48.45,58.7 S4.3 S4.6 | C1.2 56.1,17.5 55.75,17.15
  Top 0.406: SW1.1 SW1.2 | JP_3V3.20 JP_3V3.18 JP_3V3.16 JP_3V3.14 JP_3V3.12 JP_3V3.10 JP_3V3.8 JP_3V3.6 JP_3V3.4 JP_3V3.2 JP_5V5.20 JP_5V5.18 JP_5V5.16 JP_5V5.14 JP_5V5.12 JP_5V5.10 JP_5V5.8 JP_5V5.6 JP_5V5.4 JP_5V5.2
  Top 0.61: 9.46,95.59 U$3.1 | C3.N C4.N | USB.4 6.2,36.1 4.6,37.7 4.6,39 8.8,43.2 8.8,51.25 6.46,53.59 X1.2 | C5.N 36.7,84 C6.N
  Bottom 0.3: v24.85,78.95 24.3,78.4 v24.3,72.75 | v68.45,56.35 72.15,56.35 72.8,57 72.8,59.65 73.5,60.35 82.65,60.35 v82.7,60.3 | v43.05,52.67 v43.05,57.85 44.95,57.85 46.4,56.4 47.75,56.4 48.1,56.75 v48.1,58.35 | v40.6,60.95 40.6,67 | v36.1,67.95 39.65,67.95 40.6,67 | 40.6,67 41,67.4 46.45,67.4 48,68.95 50.2,68.95 51.25,70 v51.25,71.4 51.25,77.3 51.75,77.8 61.05,77.8 64.85,74 v66.35,74
  Bottom 0.61: J1.3 3.4,61.15 J1.2 6.4,55.74 X1.2
  other vias: 58.2,18.9 49.8,15.1
  pour Top (isolate 0.61): 0.05,100.1 0.05,0.3 99.25,0.3 99.25,100.1
  pour Bottom (isolate 0.61): 0.05,100.1 0.05,0.3 99.15,0.3 99.15,100.1
MCLR  (via drill 0.4)
  Top 0.3: PICKIT.1 6.15,27.7 9.83,31.38 SW1.4 | IC1.18 45.39,26.81 45.15,27.05 40.55,27.05 39.55,26.05 v32.4,26.05 36.79,26.05 37.47,25.37 R1.1 | v32.35,31.1 32.07,31.38 SW1.3
  Top 0.406: SW1.4 SW1.3
  Bottom 0.3: v32.4,26.05 32.35,26.1 v32.35,31.1
N$1  (via drill 0.4)
  Top 0.3: S1.2 v30.35,63.25 S1.5 | R23.2 25.85,51.7 26.5,52.35 26.5,56.6 27.4,57.5 v29.95,57.5
  Bottom 0.3: v29.95,57.5 29.95,62.85 v30.35,63.25
N$2
  Top 0.3: S3.5 S3.2 36.5,63.45 35.35,62.3 35.35,57.85 34.65,57.15 R24.2
N$3  (via drill 0.4)
  Top 0.3: S4.5 S4.2 47.65,62.8 45.9,62.8 45.45,62.35 45.45,57.45 44.75,56.75 v40.3,56.75 | R25.2 34.1,46.85 36.55,49.3 v36.55,50.5
  Bottom 0.3: v36.55,50.5 37.35,50.5 38.85,52 38.85,55.85 39.75,56.75 v40.3,56.75
N$4
  Top 0.3: S5.5 S5.2 59,63.6 56.9,61.5 56.9,59.35 54.95,57.4 46.55,57.4 42.2,53.05 R26.2
N$5
  Top 0.3: S6.5 S6.2 57.35,74 56.4,73.05 56.4,70.15 54.5,68.25 44,68.25 43.4,68.85 23.8,68.85 23.15,68.2 23.15,60.4 24.1,59.45 R30.2
N$6  (via drill 0.4)
  Top 0.3: S7.5 S7.2 47.05,73.9 46.05,72.9 v46.05,70.9 | R29.2 21.2,61.47 22.4,62.67 22.4,68.65 v22.35,68.7
  Bottom 0.3: v46.05,70.9 43.95,68.8 25.6,68.8 25.5,68.7 v22.35,68.7
N$7  (via drill 0.4)
  Top 0.3: v35.65,70.8 35.65,73.3 36.2,73.85 S8.2 S8.5 | R28.2 17.9,60.25 16.68,61.47 16.68,65.29 21.79,70.4 23.95,70.4 v23.95,70.35
  Bottom 0.3: v35.65,70.8 34.7,69.85 24.45,69.85 v23.95,70.35
N$8
  Top 0.3: S9.5 S9.2 21.25,73.85 14.89,67.49 14.89,59.24 R27.2
N$9
  Top 0.3: R2.2 47.4,86.1 47.4,83.8 48,83.2 L1.C
N$10
  Top 0.3: R3.2 49.45,85.55 51.8,83.2 LED2.C
N$11
  Top 0.3: R4.2 53.75,86.3 55.85,84.2 LED3.C
N$12
  Top 0.3: R5.2 57.45,86.75 59.3,84.9 L4.C
N$13
  Top 0.3: R6.2 61.45,86.9 62.95,85.4 62.95,83.3 L5.C
N$14
  Top 0.3: R7.2 65.45,83.85 LED6.C
N$15
  Top 0.3: R8.2 69.45,83.6 LED7.C
N$16
  Top 0.3: R9.2 73.35,84.3 L8.C
N$17  (via drill 0.4)
  Top 0.3: L1.A 49.5,81.05 v49.5,79.1
  Bottom 0.3: v49.5,79.1 49.5,89.65 51.1,91.25 74.54,91.25 LEDS1.1
N$18  (via drill 0.4)
  Top 0.3: LED2.A 53.05,81.05 v53.05,79.05
  Bottom 0.3: v53.05,79.05 53.05,87.65 54.4,89 72.3,89 73.75,87.55 77.45,87.55 78.73,88.83 LEDS1.2
N$19
  Top 0.3: LEDS1.3 81.27,91.42 81.6,91.75 85.6,91.75 86.1,91.25 86.1,81.2 83.95,79.05 69,79.05 67.85,77.9 57.55,77.9 55.85,79.6 LED3.A
N$20  (via drill 0.4)
  Top 0.3: L4.A 59.9,81.1 61.25,82.45 v61.25,84.7
  Bottom 0.3: v61.25,84.7 63.55,87 82.7,87 83.81,88.11 LEDS1.4
N$21  (via drill 0.4)
  Top 0.3: L5.A 61.75,81.1 61.25,80.6 v61.25,79.15
  Bottom 0.3: v61.25,79.15 61.2,79.2 61.2,80.65 62.9,82.35 75.55,82.35 76.14,82.94 LEDS2.1
N$22  (via drill 0.4)
  Top 0.3: LED6.A 66.05,81.05 65.7,81.05 65.5,80.85 v65.5,79
  Bottom 0.3: v65.5,79 65.5,80.8 66.35,81.65 77.9,81.65 78.68,82.43 LEDS2.2
N$23
  Top 0.3: LEDS2.3 81.22,86.42 82,87.2 84.6,87.2 85.25,86.55 85.25,81.8 83.25,79.8 69.95,79.8 69.05,80.7 LED7.A
N$24
  Top 0.3: L8.A 72.75,80.6 82.45,80.6 83.8,81.95 83.8,84.86 LEDS2.4
N$25  (via drill 0.4)
  Top 0.3: v75.25,42.15 76.65,43.55 S10.1 78.6,42.65 R10.2
  Bottom 0.3: BTN_A.1 45.79,52.81 49.6,49 63.8,49 70.6,42.2 75.2,42.2 v75.25,42.15
N$26  (via drill 0.4)
  Top 0.3: v75.55,47.15 76.45,48.05 S11.1 78.2,47.6 R11.2
  Bottom 0.3: BTN_A.2 48.33,51.92 50.55,49.7 65.95,49.7 68.5,47.15 v75.55,47.15
N$27  (via drill 0.4)
  Top 0.3: S12.1 76.55,53.8 v76.55,51.2 77.55,52.2 R12.2
  Bottom 0.3: BTN_A.3 50.87,52.03 52.5,50.4 68,50.4 69.3,49.1 74.45,49.1 v76.55,51.2
N$28  (via drill 0.4)
  Top 0.3: v74.3,58.25 74.45,58.4 S13.1 78.2,56.7 R13.2
  Bottom 0.3: BTN_A.4 53.41,52.14 54.45,51.1 72.75,51.1 74.1,52.45 74.1,58.05 v74.3,58.25
N$29  (via drill 0.4)
  Top 0.3: v78.65,75.75 77.1,77.3 S14.1 R14.2
  Bottom 0.3: BTN_B.4 65.01,58.31 67.8,61.1 76.85,61.1 78.65,62.9 v78.65,75.75
N$30  (via drill 0.4)
  Top 0.3: BTN_B.3 62.47,52.02 61.4,50.95 56.35,50.95 55,52.3 55,55.2 v54.05,56.15 | v73.6,72.85 73.7,72.75 S15.1 80.7,72.75 R15.2
  Bottom 0.3: v54.05,56.15 54.05,70.1 56.8,72.85 v73.6,72.85
N$31  (via drill 0.4)
  Top 0.3: BTN_B.2 59.93,55.67 59.25,56.35 v55.5,56.35 | v73.5,68.15 76.4,68.15 S16.1 79.4,68.05 80.7,68.05 80.75,68.05 R16.2
  Bottom 0.3: v55.5,56.35 55.5,65.65 58,68.15 v73.5,68.15
N$32  (via drill 0.4)
  Top 0.3: v73.35,63.5 76.35,63.5 S17.1 79.4,63.45 80.6,62.25 R17.2
  Bottom 0.3: BTN_B.1 57.39,61.64 59.25,63.5 v73.35,63.5
N$33
  Top 0.3: R21.2 94.75,70.4 94.75,62.81 POT.3
N$34
  Top 0.3: POT.2 92.15,61.85 92.15,59.65 92.95,58.85 95.7,58.85 97.4,60.55 97.4,79.5 95.7,81.2 R20.2
N$35
  Bottom 0.3: POT.1 89.16,65.06 90.35,66.25 93.35,66.25 95.7,68.6 95.7,89.15 93.2,91.65 R19.2
N$36
  Top 0.61: IC2.1 22.04,83.16 22.9,84.02 24.23,84.02 C5.P
  Bottom 0.61: X1.1 9.34,48.59 12.15,51.4 12.15,60.3 J1.1 9.8,63.25 10,63.25 13.3,66.55 17.3,66.55 22.04,71.29 IC2.1
N$37
  Top 0.3: JP_SLIDES_UP.1 14.85,54.54 R27.1
N$38
  Top 0.3: JP_SLIDES_UP.2 17.9,54.03 R28.1
N$39
  Top 0.3: JP_SLIDES_UP.3 21.27,57.23 R29.1
N$40
  Top 0.3: R26.1 37.86,54.95 JP_SLIDES_DOWN.1
N$41
  Top 0.3: R25.1 34.02,49.67 JP_SLIDES_DOWN.2
N$42
  Top 0.3: JP_SLIDES_DOWN.3 31.48,56.68 R24.1
N$43
  Top 0.3: R23.1 27.75,49.76 28.94,50.95 JP_SLIDES_DOWN.4
N$44
  Top 0.3: JP_SLIDES_UP.4 24.1,53.49 R30.1
RA0
  Top 0.3: PORTAH.1 29.37,19.47 30.75,20.85 45.4,20.85 46.19,21.64 IC1.19
  Bottom 0.3: PA.1 29.62,4.03 29.2,4.45 29.2,11.27 PORTAM.1 29.35,14.92 PORTAH.1
RA1
  Top 0.3: PORTAH.2 31.91,19.76 32.45,20.3 45.9,20.3 46.99,21.39 IC1.20
  Bottom 0.3: PA.2 31.33,6.57 31.1,6.8 31.1,10.63 PORTAM.2 31.89,14.92 PORTAH.2
RA2
  Top 0.3: PORTAH.3 34.45,19.05 35.1,19.7 46.7,19.7 47.79,20.79 IC1.21
  Bottom 0.3: PA.3 35.07,4.03 34.35,4.75 34.35,11.34 PORTAM.3 34.43,14.92 PORTAH.3
RA3
  Top 0.3: PORTAH.4 36.99,18.44 37.65,19.1 47.25,19.1 48.59,20.44 IC1.22
  Bottom 0.3: PA.4 35.56,10.01 PORTAM.4 36.97,14.92 PORTAH.4
RA4  (via drill 0.4)
  Top 0.3: IC1.23 49.9,26.59 v49.9,23.5
  Bottom 0.3: PA.5 36.75,5.38 36.75,8.7 37.65,9.6 38.65,9.6 39.51,10.46 PORTAM.5 39.51,14.92 PORTAH.5 39.53,18.09 40.79,19.35 48.4,19.35 49.4,20.35 49.4,23 v49.9,23.5
RA5
  Top 0.3: PORTAH.6 42.07,17.47 42.9,18.3 49.1,18.3 52.3,21.5 52.3,27.55 51.97,27.88 IC1.24
  Bottom 0.3: PA.6 38.1,8.65 38.35,8.9 39.8,8.9 42.1,11.2 42.1,11.37 PORTAM.6 42.05,14.92 PORTAH.6
RA6  (via drill 0.4)
  Top 0.3: IC1.31 52.83,33.48 v52.85,33.5 | PORTAH.7 44.61,16.91 45.41,17.71 49.47,17.71 49.89,18.12 v50.98,18.12 51.5,18.65 53.95,18.65 C1.1 54.1,19.6 55.5,21 55.5,23.95 | 55.5,23.95 Y1.1 55.35,24.1 55.5,23.95
  Bottom 0.3: PA.7 39.35,5.32 39.35,7.6 41,9.25 43,9.25 44.59,10.84 PORTAM.7 44.59,14.92 PORTAH.7 | v52.85,33.5 52.85,20 v50.98,18.12
RA7  (via drill 0.4)
  Top 0.3: IC1.30 54.43,32.68 Y1.2 55.5,35.1 55.15,35.45 v53.35,35.45 52.35,36.45 C2.1
  Bottom 0.3: PA.8 40.64,7.74 41.45,8.55 46.15,8.55 47.15,9.55 47.15,11.4 PORTAM.8 47.13,14.92 PORTAH.8 47.15,17.05 51.75,21.65 51.75,34.65 52.55,35.45 v53.35,35.45
RB0
  Top 0.3: PORTBH.1 7.72,27.12 10.1,29.5 38.77,29.5 IC1.8
  Bottom 0.3: PB.1 8.47,4.03 7.72,4.78 PORTBM.1 PORTBH.1
RB1
  Top 0.3: PORTBH.2 10.16,15.09 10.16,26.11 12.8,28.75 38.72,28.75 IC1.9
  Bottom 0.3: PB.2 10.26,7.53 PORTBM.2 PORTBH.2
RB2
  Top 0.3: IC1.10 14.13,27.88 12.75,26.5 12.75,15.04 PORTBH.3
  Bottom 0.3: PB.3 12.45,5.34 12.45,9.2 12.8,9.55 PORTBM.3 PORTBH.3
RB3
  Top 0.3: IC1.11 16.93,27.08 15.3,25.45 15.3,15.03 PORTBH.4
  Bottom 0.3: PB.4 13.76,9.26 15.34,10.84 PORTBM.4 PORTBH.4
RB4  (via drill 0.4)
  Top 0.3: IC1.14 42.19,23.78 40.94,22.53 37.58,22.53 v37,21.95 | v17.95,21.15 17.95,15.06 PORTBH.5
  Bottom 0.3: PB.5 14.95,5.38 14.95,8.7 15.7,9.45 16.9,9.45 17.88,10.43 PORTBM.5 PORTBH.5 | v37,21.95 18.75,21.95 v17.95,21.15 | v17.95,21.15
RB5  (via drill 0.4)
  Top 0.3: IC1.15 42.99,23.29 v41.55,21.85 | v20.35,22.85 20.35,15.06 PORTBH.6
  Bottom 0.3: PB.6 15.85,7.02 15.85,7.9 16.75,8.8 18.05,8.8 20.42,11.17 PORTBM.6 PORTBH.6 | v41.55,21.85 39,21.85 37.95,22.9 20.4,22.9 v20.35,22.85
RB6  (via drill 0.4)
  Top 0.3: IC1.16 43.79,21.69 v43.75,21.65 | v21.75,20.95 21.75,18.6 v22.96,17.39
  Bottom 0.3: PB.7 18.12,4.03 17.6,4.55 17.6,7.35 19.35,9.1 21.35,9.1 22.96,10.71 PORTBM.7 PORTBH.7 v22.96,17.39 22.25,18.1 4.81,18.1 PICKIT.5 | v43.75,21.65 43.15,21.05 21.85,21.05 v21.75,20.95
RB7  (via drill 0.4)
  Top 0.3: IC1.17 44.59,23.06 v45.35,22.3
  Bottom 0.3: PB.8 18.84,7.29 19.85,8.3 24.05,8.3 25.5,9.75 PORTBM.8 PORTBH.8 25.5,17.7 | PICKIT.4 23.12,20.08 25.5,17.7 | v45.35,22.3 45.35,20.95 44.5,20.1 25.55,20.1 25.5,20.05 25.5,17.7
RC0  (via drill 0.4)
  Top 0.3: v58,21.3 v58,35.8 | IC1.32 51.33,34.28 51.75,34.7 51.75,35.75 50.75,36.75 v50.75,36.85
  Bottom 0.3: v58,21.3 58,20.35 56.25,18.6 54.2,18.6 52.07,16.47 PORTCH.1 52.02,15.05 PORTCM.1 52.02,5.28 53.27,4.03 PC.1 | v58,35.8 58.05,35.85 58.05,37.5 55.85,39.7 52.35,39.7 50.75,38.1 v50.75,36.85
RC1  (via drill 0.4)
  Top 0.3: IC1.35 47.79,38.54 48.3,39.05 v48.85,39.05 | v25.8,26.05 27.45,24.4 27.45,9.25 28.55,8.15 54.54,8.15 PC.2
  Bottom 0.3: PC.2 54.55,8.14 PORTCM.2 54.56,15.05 PORTCH.2 | v48.85,39.05 27.45,39.05 25.8,37.4 v25.8,26.05
RC2
  Top 0.3: PORTCH.3 57.1,15.15 57.1,16.3 59.2,18.4 59.2,36.4 55.1,40.5 47.5,40.5 46.99,39.99 IC1.36
  Bottom 0.3: PC.3 58.02,4.03 57.45,4.6 57.45,8.9 56.95,9.4 56.95,11.34 PORTCM.3 57.1,15.05 PORTCH.3
RC3  (via drill 0.4)
  Top 0.3: JP_I2C.2 JP_I2C.4 JP_I2C.6 | JP_I2C.6 JP_I2C.8 | IC1.37 46.19,40.34 46.9,41.05 55.8,41.05 61.25,35.6 v61.25,33.3 61.25,18.75 59.69,17.19 PORTCH.4 | JP_I2C.6 91.75,50.06 R22.1
  Bottom 0.3: PC.4 58.66,9.56 59.64,10.54 PORTCM.4 59.64,15.05 PORTCH.4 | v61.25,33.3 63.55,35.6 83.5,35.6 86.75,38.85 86.75,49.3 88.03,50.58 JP_I2C.8
RC4  (via drill 0.4)
  Top 0.3: JP_I2C.1 JP_I2C.3 JP_I2C.5 | JP_I2C.5 JP_I2C.7 | IC1.42 42.09,36.98 42.09,42.54 44.05,44.5 58.75,44.5 62.65,40.6 v62.65,31.3 62.65,15.52 PORTCH.5 | v88.05,45.95 85.95,45.95 85.5,46.4 85.5,53.2 v85.55,53.25 | JP_I2C.5 91.7,53.59 R18.1
  Bottom 0.3: PORTCH.5 62.18,15.05 PORTCM.5 62.18,10.78 61.25,9.85 60.6,9.85 59.9,9.15 59.9,5.08 60.95,4.03 PC.5 | v62.65,31.3 86.15,31.3 87.05,32.2 87.05,37.45 88.05,38.45 v88.05,45.95 | v85.55,53.25 88.56,53.25 JP_I2C.7
RC5
  Top 0.3: IC1.43 41.39,43.09 43.45,45.15 59.35,45.15 64.77,39.73 PORTCH.6
  Bottom 0.3: PC.6 61.2,8.45 62.05,9.3 63.6,9.3 64.72,10.42 PORTCM.6 64.72,15.05 PORTCH.6
RC6  (via drill 0.4)
  Top 0.3: IC1.44 40.59,43.34 43.1,45.85 59.9,45.85 67.6,38.15 v67.6,29 67.6,15.39 PORTCH.7
  Bottom 0.3: PC.7 62.87,4.03 62.45,4.45 62.45,7.5 63.55,8.6 65.9,8.6 67.21,9.91 67.21,11.44 PORTCM.7 67.26,15.05 PORTCH.7 | SOC_UART.3 90.35,38.8 88.05,36.5 88.05,31.45 85.75,29.15 67.75,29.15 v67.6,29
RC7  (via drill 0.4)
  Top 0.3: IC1.1 38.79,43.09 42.2,46.5 60.2,46.5 68.6,38.1 v68.6,26.8 68.6,19.3 70,17.9 70,15.25 PORTCH.8
  Bottom 0.3: PC.8 63.74,7.29 64.3,7.85 68.9,7.85 69.8,8.75 PORTCM.8 69.8,15.05 PORTCH.8 | v68.6,26.8 86.05,26.8 89.05,29.8 89.05,35.4 89.91,36.26 SOC_UART.2
RD0  (via drill 0.4)
  Top 0.3: IC1.38 45.39,40.84 46.25,41.7 56.4,41.7 v61.15,36.95 | v75.85,37 75.85,15.17 PORTDH.1
  Bottom 0.3: PORTDH.1 PORTDM.1 75.93,4.47 76.37,4.03 PD.1 | v61.15,36.95 75.8,36.95 v75.85,37
RD1  (via drill 0.4)
  Top 0.3: IC1.39 44.64,36.93 44.64,41.49 45.55,42.4 56.9,42.4 v61.25,38.05 | v78.4,38.05 78.4,15.16 PORTDH.2
  Bottom 0.3: PORTDH.2 PORTDM.2 77.55,10.86 77.55,7.6 78.58,6.57 PD.2 | v61.25,38.05 v78.4,38.05
RD2  (via drill 0.4)
  Top 0.3: IC1.40 43.84,36.93 43.84,41.94 45.05,43.15 57.4,43.15 v61.35,39.2 | v81.15,39.15 81.15,15.23 PORTDH.3
  Bottom 0.3: PORTDH.3 PORTDM.3 81.01,5.38 PD.3 | v61.35,39.2 81.1,39.2 v81.15,39.15
RD3  (via drill 0.4)
  Top 0.3: IC1.41 42.99,42.39 44.45,43.85 58.1,43.85 v61.4,40.55 | v79.8,40.35 82.25,40.35 83.55,39.05 PORTDH.4
  Bottom 0.3: PD.4 82.36,9.41 83.55,10.6 PORTDM.4 PORTDH.4 | v61.4,40.55 61.6,40.35 v79.8,40.35
RD4  (via drill 0.4)
  Top 0.3: IC1.2 37.47,34.28 37,34.75 37,43.25 40.9,47.15 60.75,47.15 69.85,38.05 v69.85,19.7
  Bottom 0.3: v69.85,19.7 69.9,19.65 84.95,19.65 86.2,18.4 86.2,15.2 PORTDH.5 PORTDM.5 86.09,10.74 83.65,8.3 83.65,5.28 PD.5
RD5  (via drill 0.4)
  Top 0.3: IC1.3 36.77,33.48 35.65,34.6 35.65,43.25 40.2,47.8 61.35,47.8 70.75,38.4 v70.75,25.65 | v84.9,25.7 85.95,25.7 88.63,23.02 PORTDH.6
  Bottom 0.3: PD.6 84.9,8.15 86.55,9.8 87.3,9.8 88.63,11.13 PORTDM.6 PORTDH.6 | v70.75,25.65 84.85,25.65 v84.9,25.7
RD6  (via drill 0.4)
  Top 0.3: IC1.4 36.27,32.68 34.8,34.15 34.8,43.45 39.8,48.45 62.05,48.45 71.9,38.6 v71.9,28.3 | v84.85,28.3 91.17,21.98 PORTDH.7
  Bottom 0.3: PORTDH.7 PORTDM.7 91.17,9.92 90.55,9.3 88.05,9.3 86.2,7.45 86.2,5.27 PD.7 | v71.9,28.3 v84.85,28.3
RD7
  Top 0.3: IC1.5 35.62,31.88 33.95,33.55 33.95,43.95 39.15,49.15 62.5,49.15 72.8,38.85 72.8,9.2 73.55,8.45 85.56,8.45 PD.8
  Bottom 0.3: PD.8 87.44,7.84 88.1,8.5 93.3,8.5 93.71,8.91 PORTDM.8 PORTDH.8
RE0  (via drill 0.4)
  Top 0.3: v53.7,20.9 53.7,27.75 52.79,28.66 50.41,28.66 IC1.25
  Bottom 0.3: v53.7,20.9 53.7,21.35 54.7,22.35 92.91,22.35 PORTEH.1 96.85,21.66 PORTEM.1
RE1  (via drill 0.4)
  Top 0.3: v56.65,27.95 54.55,27.95 53.02,29.48 IC1.26
  Bottom 0.3: v56.65,27.95 56.7,27.9 60.8,27.9 65.35,23.35 92.75,23.35 PORTEH.2 96.85,24.2 PORTEM.2
RE2  (via drill 0.4)
  Top 0.3: IC1.27 53.27,30.28 54.75,28.8 v55.45,28.8
  Bottom 0.3: v55.45,28.8 61.55,28.8 65.8,24.55 88.8,24.55 90.99,26.74 PORTEH.3 96.85,26.74 PORTEM.3
VCC  (via drill 0.4)
  Top 0.3: PWR_SLIDE.5 PWR_SLIDE.2 v21.4,38.3 | IC1.28 48.38,31.08 47.58,30.28 IC1.7 15.37,30.28 v15.2,30.45 | R1.2 33.27,24.67 v33.25,24.65 | 75.35,5.35 88.95,5.35 89.98,6.38 PD.10 | 49.8,2.45 28.45,2.45 24.33,6.57 PB.10 19.55,8.4 7.4,8.4 6.35,9.45 6.35,24.45 5.64,25.16 PICKIT.2 | 49.8,2.45 72.45,2.45 75.35,5.35 | 75.35,5.35 75.4,5.4 74.23,6.57 PC.10 | 49.8,2.45 49.05,3.2 49.05,5.8 48.28,6.57 PA.10 | S9.1 S9.4 S8.1 S8.4 48.4,76.35 S7.1 S7.4 58.65,76.4 S6.1 S6.4 69.35,76.5 | v89.8,43.95 89.8,47.55 R22.2 87.8,47.6 87,48.4 87,55.35 88.2,56.55 R18.2 v87.6,58.75 | 69.35,76.5 69.5,76.5 S14.2 | S14.2 S15.2 70.3,68.15 S16.2 70.2,63.55 S17.2 | 67.45,66.1 S17.2 | 67.45,66.1 S5.4 S5.1 S4.4 S4.1 48.3,65.95 S3.4 S3.1 37.7,65.75 S1.4 S1.1 26.55,65.75 v24.75,63.95 | S17.2 70.1,58.5 S13.2 S12.2 70.2,49.4 S11.2 70.15,44.8 S10.2 | v13.5,63.5 11.4,65.6 v11.4,68.4 | S14.2 72.8,74.8 v81.5,74.8 | 67.45,66.1 67.7,66.35 67.7,74.85 69.35,76.5
  Top 0.406: JP_5V5.1 JP_5V5.3 JP_5V5.5 JP_5V5.7 JP_5V5.9 JP_5V5.11 JP_5V5.13 JP_5V5.15 JP_5V5.17 JP_5V5.19
  Top 0.61: v11.4,68.4 11.4,71.65 C3.P | U$3.3 7.7,88.1 5.55,85.95 v3.7,85.95
  Bottom 0.3: v33.25,24.65 17.15,24.65 15.2,26.6 | 15.2,26.6 v15.2,30.45 15.2,37.85 15.65,38.3 v21.4,38.3 26.35,43.25 31.15,43.25 33,45.1 | PICKIT.2 13.76,25.16 15.2,26.6 | v89.8,43.95 95.48,43.95 SOC_UART.5 | v24.75,63.95 26.65,65.85 33.6,65.85 35.3,64.15 35.3,46.4 34,45.1 33,45.1 | 33,45.1 16.15,45.1 13.55,47.7 13.55,63.5 v13.5,63.5 | v81.5,74.8 84.3,74.8 87.95,78.45 | 87.95,87.8 87.95,91.35 87.2,92.1 60.65,92.1 58.77,93.98 JP_5V5.19 | R21.1 89.39,67.86 | R19.1 89.26,89.11 87.95,87.8 | v87.6,58.75 86.95,59.4 86.95,65.42 89.39,67.86 | 87.95,78.45 87.95,80 | 87.95,80 87.95,87.8 | R20.1 89.29,78.66 87.95,80 | 87.95,78.45 87.95,69.3 89.39,67.86
  Bottom 0.61: v3.7,85.95 6.55,83.1 6.55,69.6 7.75,68.4 v11.4,68.4
VEXT  (via drill 0.4)
  Top 0.3: PWR_SLIDE.6 11.3,40.8 10.55,41.55 10.55,57.9 6.7,61.75 v6.7,66.3 | v40.15,85.85 42.25,85.85 C6.P
  Top 0.61: PWR_SLIDE.3 PWR_SLIDE.6
  Bottom 0.3: v40.15,85.85 38,88 19.1,88 16.96,85.86 IC2.3 14.05,76.2 14.05,69.65 10.7,66.3 v6.7,66.3
VUSB
  Top 0.3: USB.1 12.7,36.1 PWR_SLIDE.4
  Top 0.406: PWR_SLIDE.1 PWR_SLIDE.4

### Text on the board
tNames: VEXTERNAL | COMMON | VUSB | < | VPP | VDD | VSS | PGD | PGC